# Altium schematic sheet Amplifier.SchDoc
size 863 x 558 mm
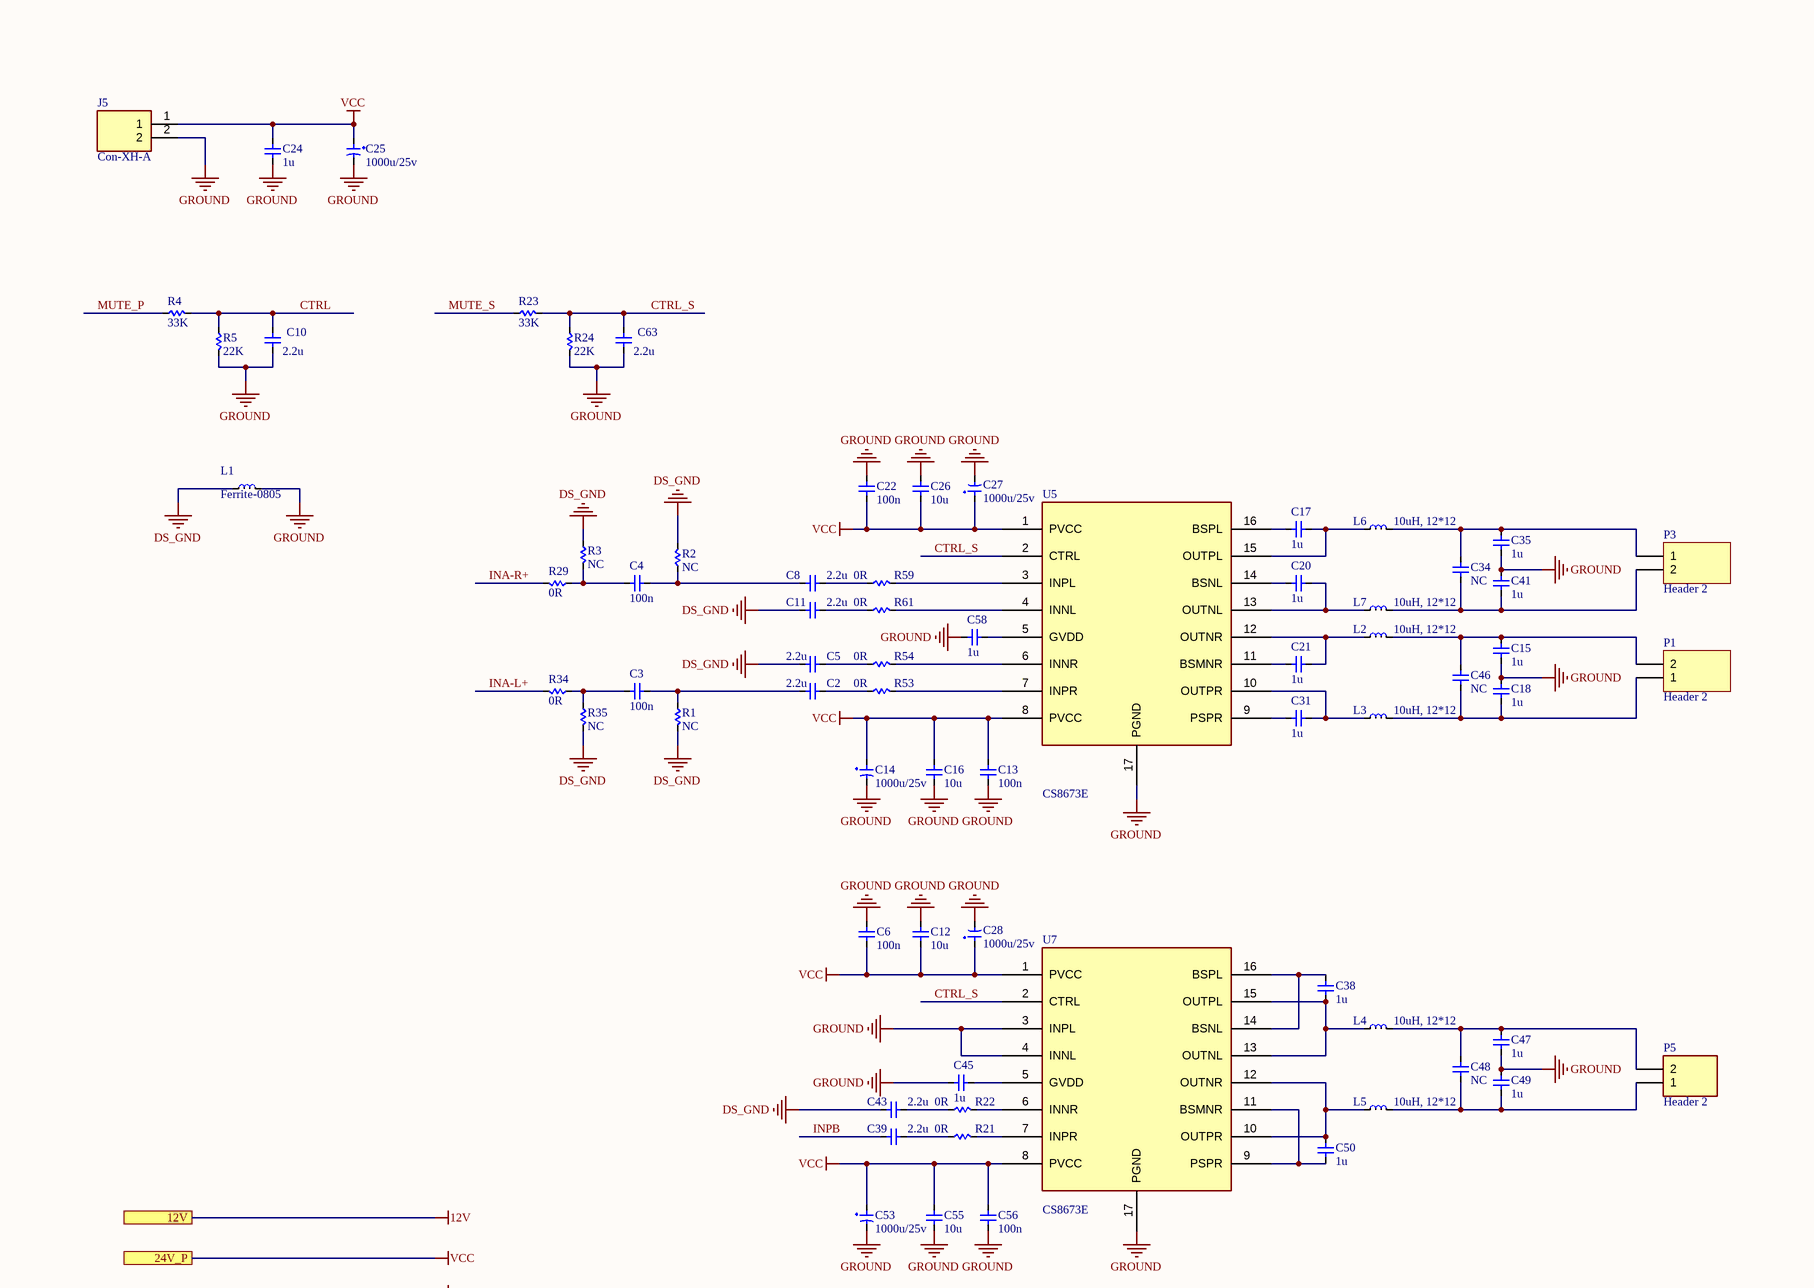
[diagram p0: Amplifier.SchDoc, top left]
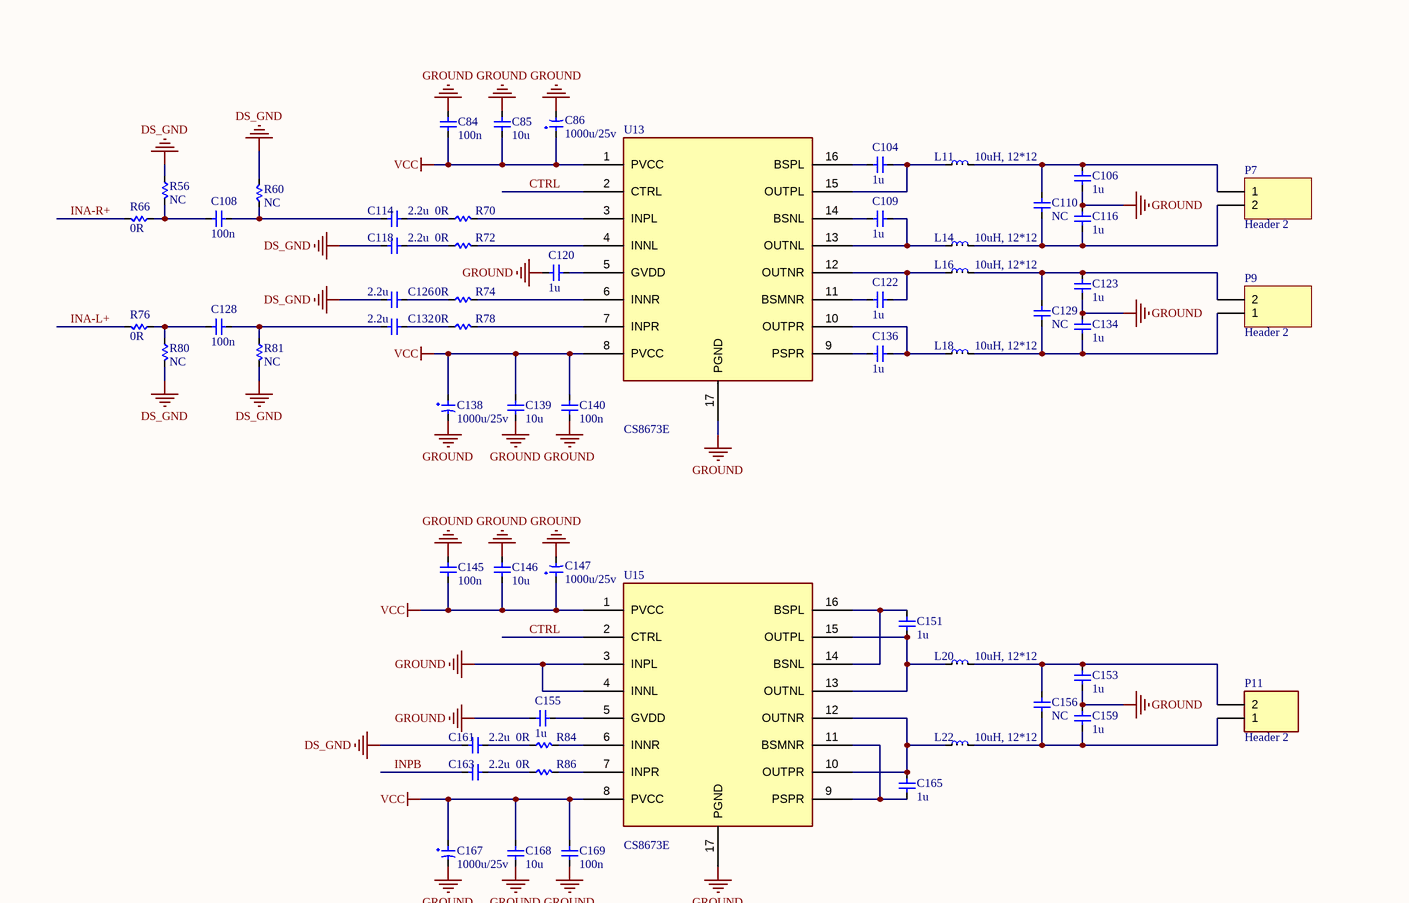
[diagram p1: Amplifier.SchDoc, top middle]
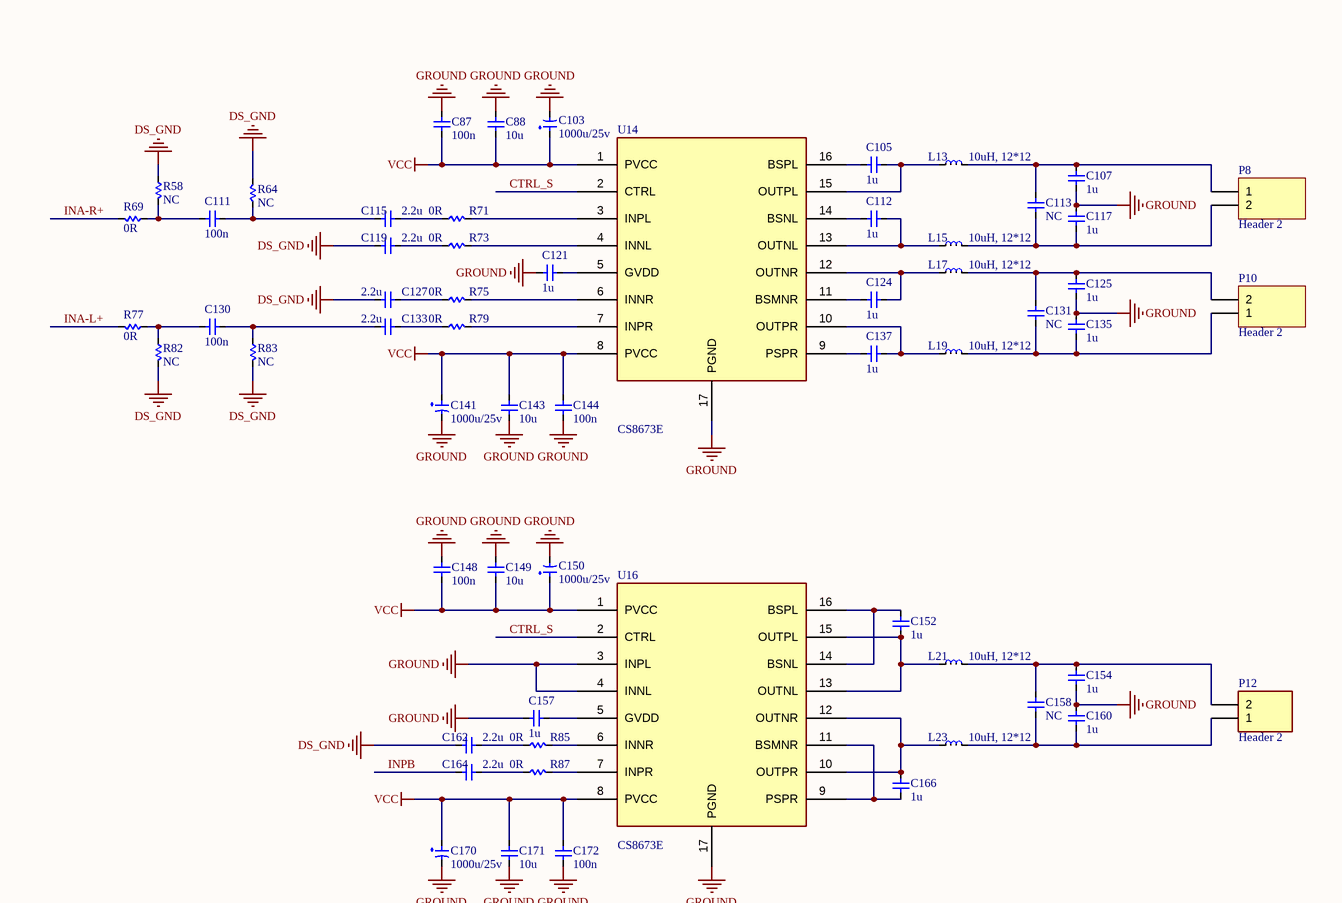
[diagram p2: Amplifier.SchDoc, top right]
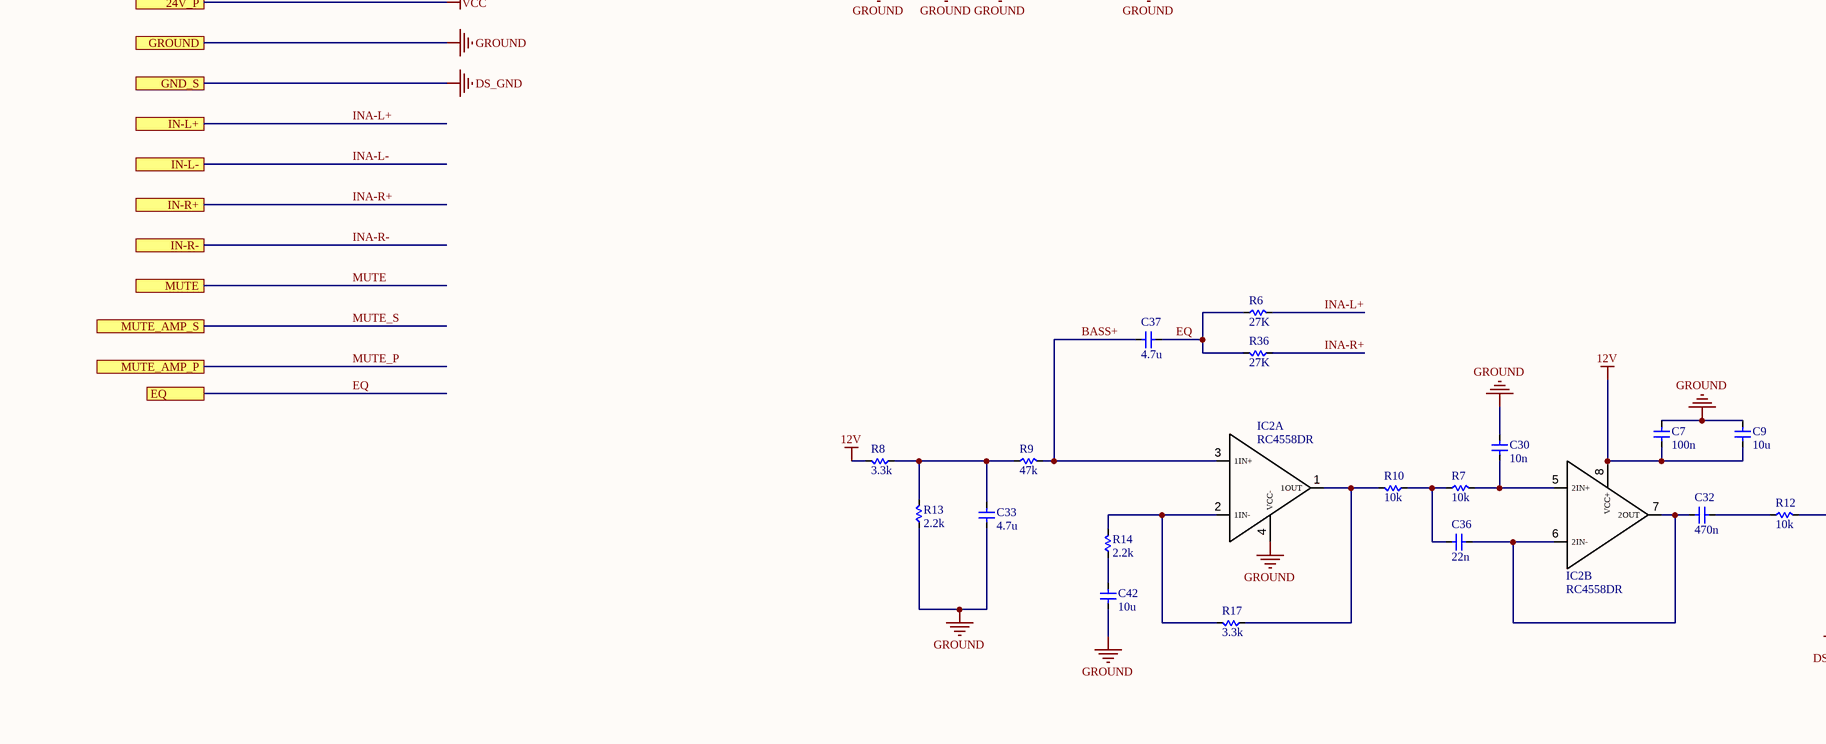
[diagram p3: Amplifier.SchDoc, bottom left]
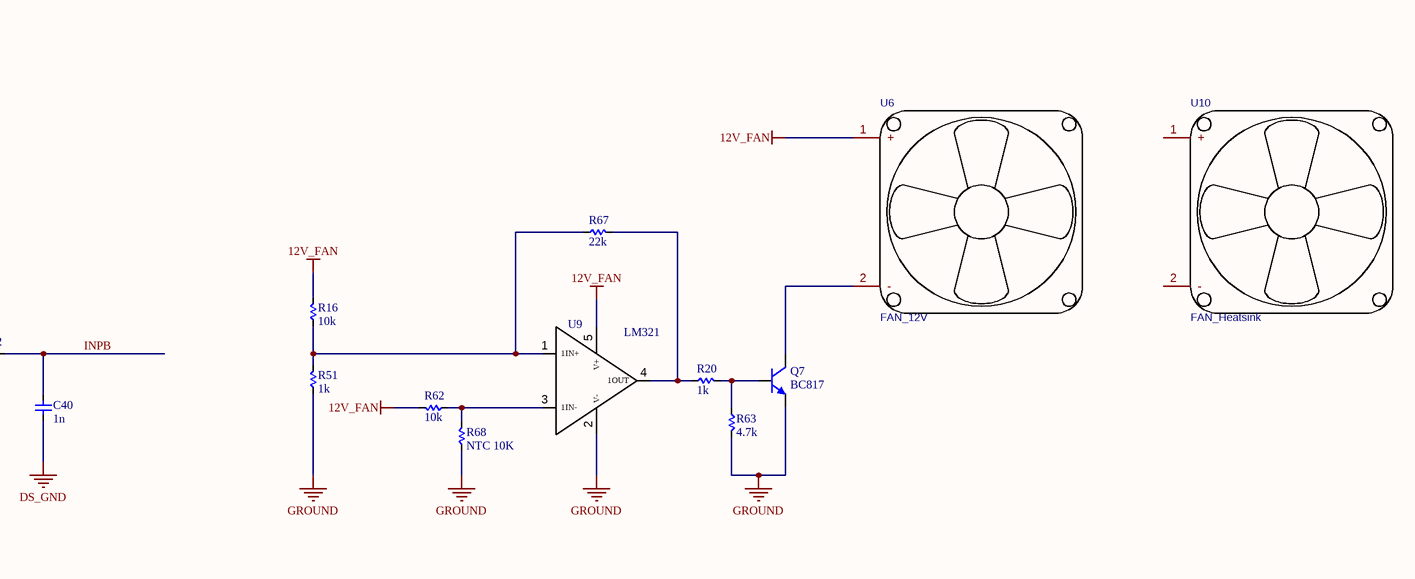
[diagram p4: Amplifier.SchDoc, bottom middle]

## Parts
C2  2.2u  [cap0603]
C3  100n  [cap0603]
C4  100n  [cap0603]
C5  2.2u  [cap0603]
C6  100n  [cap0603]
C7  100n  [cap0603]
C8  2.2u  [cap0603]
C9  10u  [cap0603]
C10  2.2u  [cap0603]
C11  2.2u  [cap0603]
C12  10u  [CAP 0805]
C13  100n  [cap0603]
C14  1000u/25v  [CAP DIP 10*13]
C15  1u  [CAP 0805]
C16  10u  [CAP 0805]
C17  1u  [CAP 0805]
C18  1u  [CAP 0805]
C20  1u  [CAP 0805]
C21  1u  [CAP 0805]
C22  100n  [cap0603]
C24  1u  [cap0603]
C25  1000u/25v  [CAP DIP 10*13]
C26  10u  [CAP 0805]
C27  1000u/25v  [CAP DIP 10*13]
C28  1000u/25v  [CAP DIP 10*13]
C30  10n  [cap0603]
C31  1u  [CAP 0805]
C32  470n  [cap0603]
C33  4.7u  [cap0603]
C34  NC  [CAP 0805]
C35  1u  [CAP 0805]
C36  22n  [cap0603]
C37  4.7u  [cap0603]
C38  1u  [CAP 0805]
C39  2.2u  [cap0603]
C40  1n  [cap0603]
C41  1u  [CAP 0805]
C42  10u  [CAP 1206]
C43  2.2u  [cap0603]
C45  1u  [cap0603]
C46  NC  [CAP 0805]
C47  1u  [CAP 0805]
C48  NC  [CAP 0805]
C49  1u  [CAP 0805]
C50  1u  [CAP 0805]
C53  1000u/25v  [CAP DIP 10*13]
C55  10u  [CAP 0805]
C56  100n  [cap0603]
C58  1u  [cap0603]
C63  2.2u  [cap0603]
C84  100n  [cap0603]
C85  10u  [CAP 0805]
C86  1000u/25v  [CAP DIP 10*13]
C87  100n  [cap0603]
C88  10u  [CAP 0805]
C103  1000u/25v  [CAP DIP 10*13]
C104  1u  [CAP 0805]
C105  1u  [CAP 0805]
C106  1u  [CAP 0805]
C107  1u  [CAP 0805]
C108  100n  [cap0603]
C109  1u  [CAP 0805]
C110  NC  [CAP 0805]
C111  100n  [cap0603]
C112  1u  [CAP 0805]
C113  NC  [CAP 0805]
C114  2.2u  [cap0603]
C115  2.2u  [cap0603]
C116  1u  [CAP 0805]
C117  1u  [CAP 0805]
C118  2.2u  [cap0603]
C119  2.2u  [cap0603]
C120  1u  [cap0603]
C121  1u  [cap0603]
C122  1u  [CAP 0805]
C123  1u  [CAP 0805]
C124  1u  [CAP 0805]
C125  1u  [CAP 0805]
C126  2.2u  [cap0603]
C127  2.2u  [cap0603]
C128  100n  [cap0603]
C129  NC  [CAP 0805]
C130  100n  [cap0603]
C131  NC  [CAP 0805]
C132  2.2u  [cap0603]
C133  2.2u  [cap0603]
C134  1u  [CAP 0805]
C135  1u  [CAP 0805]
C136  1u  [CAP 0805]
C137  1u  [CAP 0805]
C138  1000u/25v  [CAP DIP 10*13]
C139  10u  [CAP 0805]
C140  100n  [cap0603]
C141  1000u/25v  [CAP DIP 10*13]
C143  10u  [CAP 0805]
C144  100n  [cap0603]
C145  100n  [cap0603]
C146  10u  [CAP 0805]
C147  1000u/25v  [CAP DIP 10*13]
C148  100n  [cap0603]
C149  10u  [CAP 0805]
C150  1000u/25v  [CAP DIP 10*13]
C151  1u  [CAP 0805]
C152  1u  [CAP 0805]
C153  1u  [CAP 0805]
C154  1u  [CAP 0805]
C155  1u  [cap0603]
C156  NC  [CAP 0805]
C157  1u  [cap0603]
C158  NC  [CAP 0805]
C159  1u  [CAP 0805]
C160  1u  [CAP 0805]
C161  2.2u  [cap0603]
C162  2.2u  [cap0603]
C163  2.2u  [cap0603]
C164  2.2u  [cap0603]
C165  1u  [CAP 0805]
C166  1u  [CAP 0805]
C167  1000u/25v  [CAP DIP 10*13]
C168  10u  [CAP 0805]
C169  100n  [cap0603]
C170  1000u/25v  [CAP DIP 10*13]
C171  10u  [CAP 0805]
C172  100n  [cap0603]
IC2  RC4558DR  [RC4558]  (parts A,B of 2)
J5  Con-XH-A  [Con-JST_B2B-XH-A]
L1  Ferrite-0805  [Ferrite-0805]
L2  10uH, 12*12  [inductor 12*12]
L3  10uH, 12*12  [inductor 12*12]
L4  10uH, 12*12  [inductor 12*12]
L5  10uH, 12*12  [inductor 12*12]
L6  10uH, 12*12  [inductor 12*12]
L7  10uH, 12*12  [inductor 12*12]
L11  10uH, 12*12  [inductor 12*12]
L13  10uH, 12*12  [inductor 12*12]
L14  10uH, 12*12  [inductor 12*12]
L15  10uH, 12*12  [inductor 12*12]
L16  10uH, 12*12  [inductor 12*12]
L17  10uH, 12*12  [inductor 12*12]
L18  10uH, 12*12  [inductor 12*12]
L19  10uH, 12*12  [inductor 12*12]
L20  10uH, 12*12  [inductor 12*12]
L21  10uH, 12*12  [inductor 12*12]
L22  10uH, 12*12  [inductor 12*12]
L23  10uH, 12*12  [inductor 12*12]
P1  Header 2  [CONN-PHOENIX-5.08]
P3  Header 2  [CONN-PHOENIX-5.08]
P5  Header 2  [CONN-PHOENIX-3.81]
P7  Header 2  [CONN-PHOENIX-5.08]
P8  Header 2  [CONN-PHOENIX-5.08]
P9  Header 2  [CONN-PHOENIX-5.08]
P10  Header 2  [CONN-PHOENIX-5.08]
P11  Header 2  [CONN-PHOENIX-3.81]
P12  Header 2  [CONN-PHOENIX-3.81]
Q7  BC817  [BC817]
R1  NC  [RES-0603]
R2  NC  [RES-0603]
R3  NC  [RES-0603]
R4  33K  [RES-0603]
R5  22K  [RES-0603]
R6  27K  [RES-0603]
R7  10k  [RES-0603]
R8  3.3k  [RES-0603]
R9  47k  [RES-0603]
R10  10k  [RES-0603]
R12  10k  [RES-0603]
R13  2.2k  [RES-0603]
R14  2.2k  [RES-0603]
R16  10k  [RES-0603]
R17  3.3k  [RES-0603]
R20  1k  [RES-0603]
R21  0R  [RES-0603]
R22  0R  [RES-0603]
R23  33K  [RES-0603]
R24  22K  [RES-0603]
R29  0R  [RES-0603]
R34  0R  [RES-0603]
R35  NC  [RES-0603]
R36  27K  [RES-0603]
R51  1k  [RES-0603]
R53  0R  [RES-0603]
R54  0R  [RES-0603]
R56  NC  [RES-0603]
R58  NC  [RES-0603]
R59  0R  [RES-0603]
R60  NC  [RES-0603]
R61  0R  [RES-0603]
R62  10k  [RES-0603]
R63  4.7k  [RES-0603]
R64  NC  [RES-0603]
R66  0R  [RES-0603]
R67  22k  [RES-0603]
R68  NTC 10K  [RES-0805]
R69  0R  [RES-0603]
R70  0R  [RES-0603]
R71  0R  [RES-0603]
R72  0R  [RES-0603]
R73  0R  [RES-0603]
R74  0R  [RES-0603]
R75  0R  [RES-0603]
R76  0R  [RES-0603]
R77  0R  [RES-0603]
R78  0R  [RES-0603]
R79  0R  [RES-0603]
R80  NC  [RES-0603]
R81  NC  [RES-0603]
R82  NC  [RES-0603]
R83  NC  [RES-0603]
R84  0R  [RES-0603]
R85  0R  [RES-0603]
R86  0R  [RES-0603]
R87  0R  [RES-0603]
U5  CS8673E  [CS8673E]
U6  FAN_12V  [FAN_Connector XH]
U7  CS8673E  [CS8673E]
U9  LM321  [LM321]
U10  FAN_Heatsink  [FAN_Heatsink]
U13  CS8673E  [CS8673E]
U14  CS8673E  [CS8673E]
U15  CS8673E  [CS8673E]
U16  CS8673E  [CS8673E]

## Ports
12V, 24V_P, EQ, GND_S, GROUND, IN-L+, IN-L-, IN-R+, IN-R-, MUTE, MUTE_AMP_P, MUTE_AMP_S

## Nets
12V: C7.2 C9.1 IC2.8(VCC+) R8.2 ; port 12V
12V_FAN: R16.2 R62.2 U6.1(+) U9.5(V+)
DS_GND: C5.2 C11.2 C40.1 C43.2 C118.2 C119.2 C126.2 C127.2 C161.2 C162.2 L1.2 R1.2 R2.2 R3.1 R35.2 R56.1 R58.1 R60.2 R64.2 R80.2 R81.2 R82.2 R83.2 ; port GND_S
GROUND: C6.2 C7.1 C9.2 C10.1 C12.1 C13.2 C14.2(NEG) C15.1 C16.1 C18.2 C22.2 C24.2 C25.2(NEG) C26.1 C27.2(NEG) C28.2(NEG) C30.1 C33.1 C35.1 C41.2 C42.1 C45.1 C47.1 C49.2 C53.2(NEG) C55.1 C56.2 C58.1 C63.1 C84.2 C85.1 C86.2(NEG) C87.2 C88.1 C103.2(NEG) C106.1 C107.1 C116.2 C117.2 C120.1 C121.1 C123.1 C125.1 C134.2 C135.2 C138.2(NEG) C139.1 C140.2 C141.2(NEG) C143.1 C144.2 C145.2 C146.1 C147.2(NEG) C148.2 C149.1 C150.2(NEG) C153.1 C154.1 C155.1 C157.1 C159.2 C160.2 C167.2(NEG) C168.1 C169.2 C170.2(NEG) C171.1 C172.2 IC2.4(VCC-) J5.2 L1.1 Q7.2(E) R5.2 R13.1 R24.2 R51.1 R63.2 R68.1 U5.17(PGND) U7.3(INPL) U7.4(INNL) U7.17(PGND) U9.2(V-) U13.17(PGND) U14.17(PGND) U15.3(INPL) U15.4(INNL) U15.17(PGND) U16.3(INPL) U16.4(INNL) U16.17(PGND) ; port GROUND
VCC: C6.1 C12.2 C13.1 C14.1(POS) C16.2 C22.1 C24.1 C25.1(POS) C26.2 C27.1(POS) C28.1(POS) C53.1(POS) C55.2 C56.1 C84.1 C85.2 C86.1(POS) C87.1 C88.2 C103.1(POS) C138.1(POS) C139.2 C140.1 C141.1(POS) C143.2 C144.1 C145.1 C146.2 C147.1(POS) C148.1 C149.2 C150.1(POS) C167.1(POS) C168.2 C169.1 C170.1(POS) C171.2 C172.1 J5.1 U5.1(PVCC) U5.8(PVCC) U7.1(PVCC) U7.8(PVCC) U13.1(PVCC) U13.8(PVCC) U14.1(PVCC) U14.8(PVCC) U15.1(PVCC) U15.8(PVCC) U16.1(PVCC) U16.8(PVCC) ; port 24V_P
BASS+: C37.1 IC2.3(1IN+) R9.2
CTRL: C10.2 R4.2 R5.1 U13.2(CTRL) U15.2(CTRL)
CTRL_S: C63.2 R23.2 R24.1 U5.2(CTRL) U7.2(CTRL) U14.2(CTRL) U16.2(CTRL)
EQ: C37.2 R6.1 R36.2 ; port EQ
INA-L+: R6.2 R34.2 R76.2 R77.2 ; port IN-L+
INA-L-: port IN-L-
INA-R+: R29.2 R36.1 R66.2 R69.2 ; port IN-R+
INA-R-: port IN-R-
INPB: C39.2 C40.2 C163.2 C164.2 R12.2
MUTE: port MUTE
MUTE_P: R4.1 ; port MUTE_AMP_P
MUTE_S: R23.1 ; port MUTE_AMP_S
NetC2_1: C2.1 C3.1 R1.1
NetC2_2: C2.2 R53.1
NetC3_2: C3.2 R34.1 R35.1
NetC4_1: C4.1 C8.2 R2.1
NetC4_2: C4.2 R3.2 R29.1
NetC5_1: C5.1 R54.1
NetC8_1: C8.1 R59.1
NetC11_1: C11.1 R61.1
NetC15_2: C15.2 C46.2 L2.1 P1.2
NetC17_1: C17.1 L6.2 U5.15(OUTPL)
NetC17_2: C17.2 U5.16(BSPL)
NetC18_1: C18.1 C46.1 L3.1 P1.1
NetC20_1: C20.1 L7.2 U5.13(OUTNL)
NetC20_2: C20.2 U5.14(BSNL)
NetC21_1: C21.1 L2.2 U5.12(OUTNR)
NetC21_2: C21.2 U5.11(BSMNR)
NetC30_2: C30.2 IC2.5(2IN+) R7.2
NetC31_1: C31.1 L3.2 U5.10(OUTPR)
NetC31_2: C31.2 U5.9(PSPR)
NetC32_1: C32.1 C36.1 IC2.6(2IN-) IC2.7(2OUT)
NetC32_2: C32.2 R12.1
NetC33_2: C33.2 R8.1 R9.1 R13.2
NetC34_1: C34.1 C41.1 L7.1 P3.2
NetC34_2: C34.2 C35.2 L6.1 P3.1
NetC36_2: C36.2 R7.1 R10.1
NetC38_1: C38.1 L4.2 U7.13(OUTNL) U7.15(OUTPL)
NetC38_2: C38.2 U7.14(BSNL) U7.16(BSPL)
NetC39_1: C39.1 R21.1
NetC42_2: C42.2 R14.1
NetC43_1: C43.1 R22.1
NetC45_2: C45.2 U7.5(GVDD)
NetC47_2: C47.2 C48.2 L4.1 P5.2
NetC48_1: C48.1 C49.1 L5.1 P5.1
NetC50_1: C50.1 L5.2 U7.10(OUTPR) U7.12(OUTNR)
NetC50_2: C50.2 U7.9(PSPR) U7.11(BSMNR)
NetC58_2: C58.2 U5.5(GVDD)
NetC104_1: C104.1 L11.2 U13.15(OUTPL)
NetC104_2: C104.2 U13.16(BSPL)
NetC105_1: C105.1 L13.2 U14.15(OUTPL)
NetC105_2: C105.2 U14.16(BSPL)
NetC106_2: C106.2 C110.2 L11.1 P7.1
NetC107_2: C107.2 C113.2 L13.1 P8.1
NetC108_1: C108.1 C114.2 R60.1
NetC108_2: C108.2 R56.2 R66.1
NetC109_1: C109.1 L14.2 U13.13(OUTNL)
NetC109_2: C109.2 U13.14(BSNL)
NetC110_1: C110.1 C116.1 L14.1 P7.2
NetC111_1: C111.1 C115.2 R64.1
NetC111_2: C111.2 R58.2 R69.1
NetC112_1: C112.1 L15.2 U14.13(OUTNL)
NetC112_2: C112.2 U14.14(BSNL)
NetC113_1: C113.1 C117.1 L15.1 P8.2
NetC114_1: C114.1 R70.1
NetC115_1: C115.1 R71.1
NetC118_1: C118.1 R72.1
NetC119_1: C119.1 R73.1
NetC120_2: C120.2 U13.5(GVDD)
NetC121_2: C121.2 U14.5(GVDD)
NetC122_1: C122.1 L16.2 U13.12(OUTNR)
NetC122_2: C122.2 U13.11(BSMNR)
NetC123_2: C123.2 C129.2 L16.1 P9.2
NetC124_1: C124.1 L17.2 U14.12(OUTNR)
NetC124_2: C124.2 U14.11(BSMNR)
NetC125_2: C125.2 C131.2 L17.1 P10.2
NetC126_1: C126.1 R74.1
NetC127_1: C127.1 R75.1
NetC128_1: C128.1 C132.1 R81.1
NetC128_2: C128.2 R76.1 R80.1
NetC129_1: C129.1 C134.1 L18.1 P9.1
NetC130_1: C130.1 C133.1 R83.1
NetC130_2: C130.2 R77.1 R82.1
NetC131_1: C131.1 C135.1 L19.1 P10.1
NetC132_2: C132.2 R78.1
NetC133_2: C133.2 R79.1
NetC136_1: C136.1 L18.2 U13.10(OUTPR)
NetC136_2: C136.2 U13.9(PSPR)
NetC137_1: C137.1 L19.2 U14.10(OUTPR)
NetC137_2: C137.2 U14.9(PSPR)
NetC151_1: C151.1 L20.2 U15.13(OUTNL) U15.15(OUTPL)
NetC151_2: C151.2 U15.14(BSNL) U15.16(BSPL)
NetC152_1: C152.1 L21.2 U16.13(OUTNL) U16.15(OUTPL)
NetC152_2: C152.2 U16.14(BSNL) U16.16(BSPL)
NetC153_2: C153.2 C156.2 L20.1 P11.2
NetC154_2: C154.2 C158.2 L21.1 P12.2
NetC155_2: C155.2 U15.5(GVDD)
NetC156_1: C156.1 C159.1 L22.1 P11.1
NetC157_2: C157.2 U16.5(GVDD)
NetC158_1: C158.1 C160.1 L23.1 P12.1
NetC161_1: C161.1 R84.1
NetC162_1: C162.1 R85.1
NetC163_1: C163.1 R86.1
NetC164_1: C164.1 R87.1
NetC165_1: C165.1 L22.2 U15.10(OUTPR) U15.12(OUTNR)
NetC165_2: C165.2 U15.9(PSPR) U15.11(BSMNR)
NetC166_1: C166.1 L23.2 U16.10(OUTPR) U16.12(OUTNR)
NetC166_2: C166.2 U16.9(PSPR) U16.11(BSMNR)
NetIC2_1: IC2.1(1OUT) R10.2 R17.1
NetIC2_2: IC2.2(1IN-) R14.2 R17.2
NetQ7_1: Q7.1(B) R20.2 R63.1
NetQ7_3: Q7.3(C) U6.2(-)
NetR16_1: R16.1 R51.2 R67.1 U9.1(1IN+)
NetR20_1: R20.1 R67.2 U9.4(1OUT)
NetR21_2: R21.2 U7.7(INPR)
NetR22_2: R22.2 U7.6(INNR)
NetR53_2: R53.2 U5.7(INPR)
NetR54_2: R54.2 U5.6(INNR)
NetR59_2: R59.2 U5.3(INPL)
NetR61_2: R61.2 U5.4(INNL)
NetR62_1: R62.1 R68.2 U9.3(1IN-)
NetR70_2: R70.2 U13.3(INPL)
NetR71_2: R71.2 U14.3(INPL)
NetR72_2: R72.2 U13.4(INNL)
NetR73_2: R73.2 U14.4(INNL)
NetR74_2: R74.2 U13.6(INNR)
NetR75_2: R75.2 U14.6(INNR)
NetR78_2: R78.2 U13.7(INPR)
NetR79_2: R79.2 U14.7(INPR)
NetR84_2: R84.2 U15.6(INNR)
NetR85_2: R85.2 U16.6(INNR)
NetR86_2: R86.2 U15.7(INPR)
NetR87_2: R87.2 U16.7(INPR)

Not connected (* = marked no-connect by the designer): U10 1(+) 2(-)

## Notes on the sheet
- DWG. NO.
- REV.
- SHT.
- REVISION
- DESCRIPTION
- DATE
- APPROVED
- THIS DOCUMENT AND THE DATA DISCLOSED HEREIN OR HEREWITH IS THE PROPERTY OF ALTIUM LIMITED AND MAY BE FREELY DISTRIBUTED IN WHOLE. NO RIGHTS ARE RESERVED OR EXPRESS OR IMPLIED WARANTEE GIVEN.
- ENG:
- DSN:
- APPROVALS
- PROJECT
- DOCUMENT REVISION:
- DESIGN ITEM:
- CHK:
- BOM:
- REFERENCE DOCUMENTS
- PROJECT REVISION:
- TITLE
- FAB DWG:
- PCB DWG:
- ASSY DWG:
- SCALE:
- SIZE
- D
- CAGE CODE
- FILE NAME
- DWG NO.
- SHEET
- OF
- REV

## Library data of the parts
C2 C5-C8 C11 C13 C22 C24 C30 C32 C36 C39 C40 C43 C45 C56 C58 C84 C87 C114 C115 C118-C121 C126 C127 C132 C133 C140 C144 C145 C148 C155 C157 C161-C164 C169 C172 = Cap 0603: Capacitor 0603; Published: 8-Jun-2000; LatestRevisionDate: 17-Jul-2002; LatestRevisionNote: Re-released for DXP Platform.; Publisher: Altium Limited; Value: *
C3 C4 C9 C10 C33 C37 C63 C108 C111 C128 C130 = Cap 0603: Capacitor 0603; Value: 104; Published: 8-Jun-2000; LatestRevisionDate: 17-Jul-2002; LatestRevisionNote: Re-released for DXP Platform.; Publisher: Altium Limited
C12 C15-C18 C20 C21 C26 C31 C34 C35 C38 C41 C46-C50 C55 C85 C88 C104-C107 C109 C110 C112 C113 C116 C117 C122-C125 C129 C131 C134-C137 C139 C143 C146 C149 C151-C154 C156 C158-C160 C165 C166 C168 C171 = Cap 0805: Capacitor 0805; Value: 104; Published: 8-Jun-2000; LatestRevisionDate: 17-Jul-2002; LatestRevisionNote: Re-released for DXP Platform.; Publisher: Altium Limited
C14 C25 C27 C28 C53 C86 C103 C138 C141 C147 C150 C167 C170 = capacitor dip 10*13: 2200ÂµF 50V Aluminum Electrolytic Capacitors Radial, Can 1000 Hrs @ 105Â°C; MF: Nichicon; MP: UVZ1H222MHD; Package: Radial Nichicon; Value: *; Price: None; SnapEDA_Link: https://www.snapeda.com/parts/UVZ1H222MHD/Nichicon/view-part/468437/?ref=snap; Availability: Unavailable
C42 = Cap 1206: Capacitor 1206; Value: 104; Published: 8-Jun-2000; LatestRevisionDate: 17-Jul-2002; LatestRevisionNote: Re-released for DXP Platform.; Publisher: Altium Limited
IC2 = RC4558DR: Integrated Circuit SOIC 8; Manufacturer_Name: Texas Instruments; Datasheet Link: http://www.ti.com/lit/gpn/rc4558; Height: 1.75mm; Manufacturer_Part_Number: RC4558DR; Arrow Part Number: RC4558DR; Arrow Price/Stock: https://www.arrow.com/en/products/rc4558dr/texas-instruments; Mouser Part Number: 595-RC4558DR; Mouser Price/Stock: https://www.mouser.co.uk/ProductDetail/Texas-Instruments/RC4558DR?qs=DXdcjUGny5OhrzskaZRdew%3D%3D
J5 = Con-B2B-XH-A: Connector Header Through Hole 2 position 0.098 _2.50mm_; MP: B2B-XH-A_LF__SN_; MF: JST Sales; Price: None; Package: None; Value: *; Availability: Unavailable; SnapEDA_Link: https://www.snapeda.com/parts/B2B-XH-A%28LF%29%28SN%29/JST%20Sales%20America%20Inc./view-part/492310/?ref=snap
L1 = Ferrite _0805: BLM Series 0805 330 Ohm 400 mA 0.58 Ohm DCR Surface Mount Ferrite Bead; MF: Murata; MP: BLM18BB331SN1D; Package: 0603 Murata; Price: None; Availability: Unavailable; SnapEDA_Link: https://www.snapeda.com/parts/BLM18BB331SN1D/Murata%20Electronics%20North%20America/view-part/?ref=snap; Value: *
L2-L7 L11 L13-L23 = INDUCTOR 12*12: Inductor round 12*12; MP: DR127-330-R; MF: Eaton; Price: None; Package: Nonstandard Eaton; Availability: Unavailable; SnapEDA_Link: https://www.snapeda.com/parts/DR127-330-R/Eaton/view-part/?ref=snap; Value: *
P1 P3 P7-P10 = CONN-Phoenix-5.08: Phoenix Connector 5.08; LatestRevisionDate: 17-Jul-2002; LatestRevisionNote: Re-released for DXP Platform.; Publisher: Altium Limited
P5 P11 P12 = CONN-Phoenix-3.81_1: Phoenix Connector 3.81; LatestRevisionDate: 17-Jul-2002; LatestRevisionNote: Re-released for DXP Platform.; Publisher: Altium Limited
Q7 = BC817: NPN General Purpose Amplifier BJT; Published: 8-Jun-2000; LatestRevisionDate: 15-Jan-2003; LatestRevisionNote: PCB Footprint 'BCY-W3/D4.7' replaced; DatasheetVersion: 1997; PackageVersion: Sep-1998; PackageReference: TO-92A; Publisher: Altium Limited; PackageDescription: TO, Flat Index; 3 In-Line, Axial Leads; Body Dia. 4.5mm; Leads 0.51 x 0.48 mm (max); ComponentLink1Description: Manufacturer Link; ComponentLink1URL: http://www.fairchildsemi.com/; ComponentLink2Description: Datasheet; ComponentLink2URL: http://www.fairchildsemi.com/ds/2N%2F2N3904.pdf
R1-R3 R29 R34 R35 R56 R58 R60 R64 R66 R69 R76 R77 R80-R83 = Res 0603: Resistor 0603; Value: 3.3k; Published: 8-Jun-2000; LatestRevisionDate: 29-May-2009; LatestRevisionNote: IPC-7351 Footprint Added.; PackageReference: J1-0603; Publisher: Altium Limited; PackageDescription: Chip Resistor
R4-R10 R12-R14 R16 R17 R20-R24 R36 R51 R53 R54 R59 R61-R63 R67 R70-R75 R78 R79 R84-R87 = Res 0603: Resistor 0603; Published: 8-Jun-2000; LatestRevisionDate: 29-May-2009; LatestRevisionNote: IPC-7351 Footprint Added.; PackageReference: J1-0603; Publisher: Altium Limited; PackageDescription: Chip Resistor
  R4-R10 R12-R14 R17 R23 R24 R36: Value: *
R68 = Res 0805: resistor 0805
U5 U7 U13-U16 = CS8673E: AB/D 2X40W BTL & 80W PBTL ESOP16; Manufacturer_Name: Chipstar; Manufacturer_Part_Number: CS8679E; Height: 2.47mm; Arrow Part Number: CS8679E; Arrow Price/Stock: https://www.arrow.com/en/products/tda7491hv13tr/stmicroelectronics; Mouser Part Number: 511-TDA7491HV13TR; Mouser Price/Stock: https://www.mouser.com/Search/Refine.aspx?Keyword=511-TDA7491HV13TR
U6 = FAN_12V: FAN 12V 40*40*10mm . XH Connector; Contributor: novasilisko; timeStamp: 1467237407; Manufacturer Part: ?; spicePre: U
U9 = LM321: Operational Amplifier 5-SOT-23; MP: OPA354AIDBVT; MF: Texas Instruments; Package: SOT-23-5 Texas Instruments; Digi-Key_Purchase_URL: https://www.digikey.de/product-detail/en/texas-instruments/OPA354AIDBVT/296-13033-1-ND/480149?utm_source=snapeda&utm_medium=aggregator&utm_campaign=symbol; SnapEDA_Link: https://www.snapeda.com/parts/OPA354AIDBVT/Texas%20Instruments/view-part/?ref=snap; Digi-Key_Part_Number: 296-13033-1-ND; Value: *
U10 = FAN_Heatsink: 55mm Aluminum Heatsink with Cooling Fan; Contributor: novasilisko; timeStamp: 1467237407; Manufacturer Part: ?; spicePre: U